# EAGLE design LEDdriverSFE_CREE_02 (EAGLE 6.4)
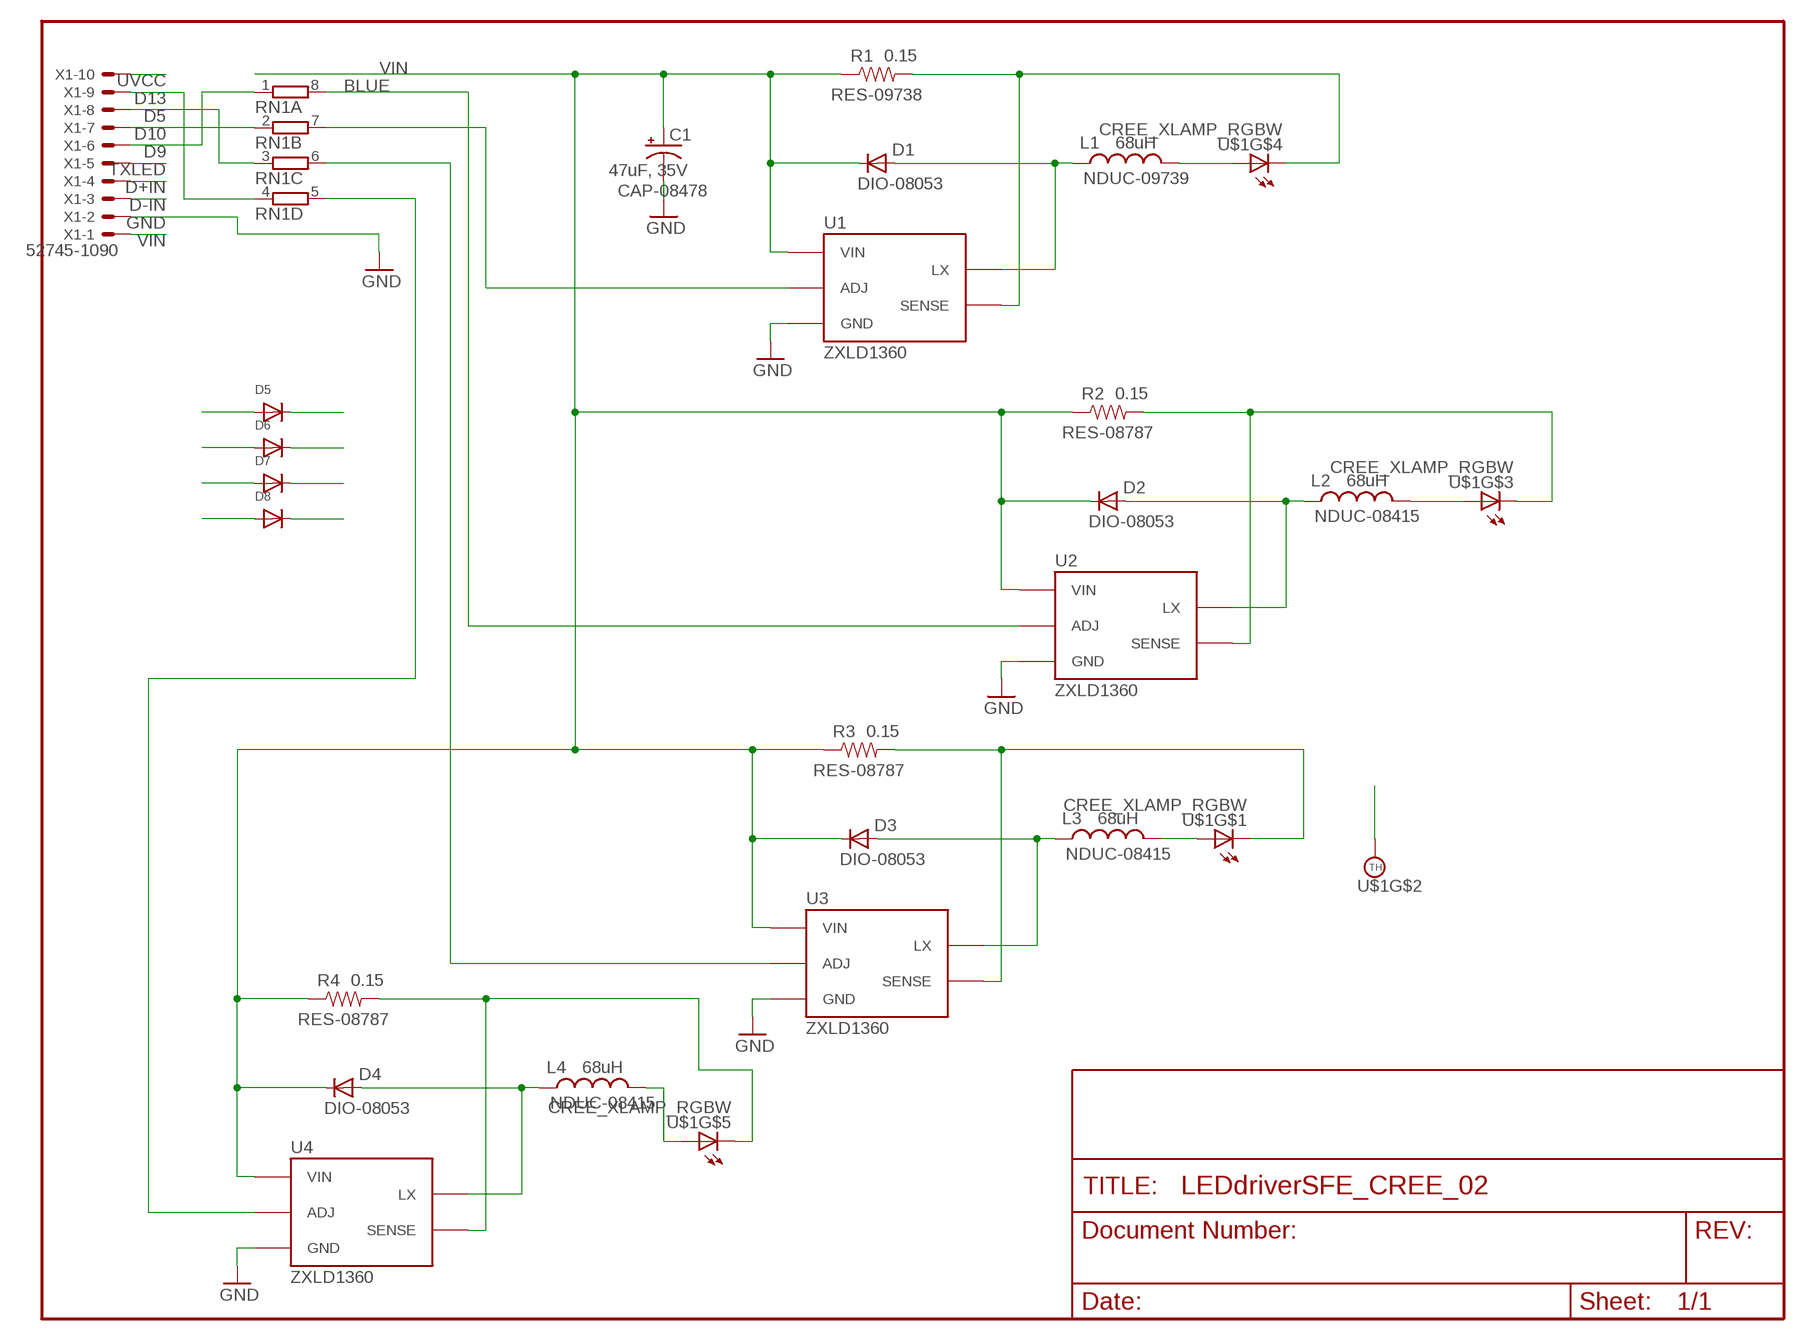
[diagram p0: schematic, sheet 1]

## Parts
C1  47uF, 35V  CAP_POLD  [PANASONIC_D]
D1  MBRA140  DIODESMA  [SMA-DIODE]
D2  MBRA140  DIODESMA  [SMA-DIODE]
D3  MBRA140  DIODESMA  [SMA-DIODE]
D4  MBRA140  DIODESMA  [SMA-DIODE]
D5  DIODESOD-323F  [SOD-323F]
D6  DIODESOD-323F  [SOD-323F]
D7  DIODESOD-323F  [SOD-323F]
D8  DIODESOD-323F  [SOD-323F]
L1  68uH  L-US  [TDK6045]
L2  68uH  L-US  [TDK6045]
L3  68uH  L-US  [TDK6045]
L4  68uH  L-US  [TDK6045]
R1  0.15  RESISTOR0603-RES  [0603-RES]
R2  0.15  RESISTOR0603-RES  [0603-RES]
R3  0.15  RESISTOR0603-RES  [0603-RES]
R4  0.15  RESISTOR0603-RES  [0603-RES]
RN1  4R-NEXBV8V  [EXBV8V]
U1  ZXLD1360  [SOT23-5]
U2  ZXLD1360  [SOT23-5]
U3  ZXLD1360  [SOT23-5]
U4  ZXLD1360  [SOT23-5]
U$1  CREE_XLAMP_RGBW  [CREE_XLAMP_XML]
X1  52745-1090  [52745-1090]

## Nets
BLUE: RN1.8 U2.3(ADJ)
D5: D8.C RN1.3 X1.8
D9: D5.C RN1.1 X1.6
D10: D6.C RN1.2 X1.7
D13: D7.C RN1.4 X1.9
D+IN: X1.4
D-IN: X1.3
GND: C1.- D5.A D6.A D7.A D8.A U1.2(GND) U2.2(GND) U3.2(GND) U4.2(GND) X1.2
GREEN: RN1.7 U1.3(ADJ)
N$1: L1.2 U$1.3(A)
N$2: D2.A L2.1 U2.1(LX)
N$3: R2.2 U2.4(SENSE) U$1.7(C)
N$4: D1.A L1.1 U1.1(LX)
N$5: R1.2 U1.4(SENSE) U$1.6(C)
N$6: L2.2 U$1.2(A)
N$7: D3.A L3.1 U3.1(LX)
N$8: R3.2 U3.4(SENSE) U$1.8(C)
N$9: L3.2 U$1.1(A)
N$11: D4.A L4.1 U4.1(LX)
N$12: R4.2 U4.4(SENSE) U$1.5(C)
N$16: L4.2 U$1.4(A)
RED: RN1.5 U4.3(ADJ)
THERM: U$1.P$1(TH)
TXLED: X1.5
UVCC: X1.10
VIN: C1.+ D1.C D2.C D3.C D4.C R1.1 R2.1 R3.1 R4.1 U1.5(VIN) U2.5(VIN) U3.5(VIN) U4.5(VIN) X1.1
WHITE: RN1.6 U3.3(ADJ)

## Notes on the sheet
- RES-09738
- DIO-08053
- NDUC-09739
- CAP-08478
- RES-08787
- DIO-08053
- NDUC-08415
- RES-08787
- DIO-08053
- NDUC-08415
- RES-08787
- DIO-08053
- NDUC-08415

## Library data of the parts
C1 = SparkFun:CAP_POL: Capacitor Polarized These are standard SMD and PTH capacitors. Normally 10uF, 47uF, and 100uF in electrolytic and tantalum varieties. Always verify the external diameter of the through hole cap, it varies with capacity, voltage, and manufacturer. The EIA devices should be standard.
D1-D4 = SparkFun:DIODE: Diode
D5-D8 = adafruit:DIODE: Diode
L1-L4 = rcl:L-US: INDUCTOR, American symbol
R1-R4 = SparkFun:RESISTOR: Resistor Basic schematic elements and footprints for 0603, 1206, and PTH 1/10th watt (small) resistors.
RN1 = resistor-dil:4R-N: Array Chip Resistor Source: RS Component / Phycomp; OC_FARNELL: unknown; OC_NEWARK: unknown
U1-U4 = SparkFun:ZXLD1360: Adjustable constant current switching driver for high-power LEDs
U$1 = led:CREE_XLAMP_RGBW: Cree XLAMP XM-L Color RGBW led http://www.mouser.com/ds/2/90/XLampXML_Color-218132.pdf
X1 = con-molex:52745-1090: FFC/FPC-to-Board 0.50mm (.020") SMT Top Contact Right Angle, ZIF, Style Receptacle 52745 / 52435 Source: http://www.molex.com/product/ffc/52745.html; MPN: 52745-1090; OC_FARNELL: unknown; OC_NEWARK: 92M6380

## Board
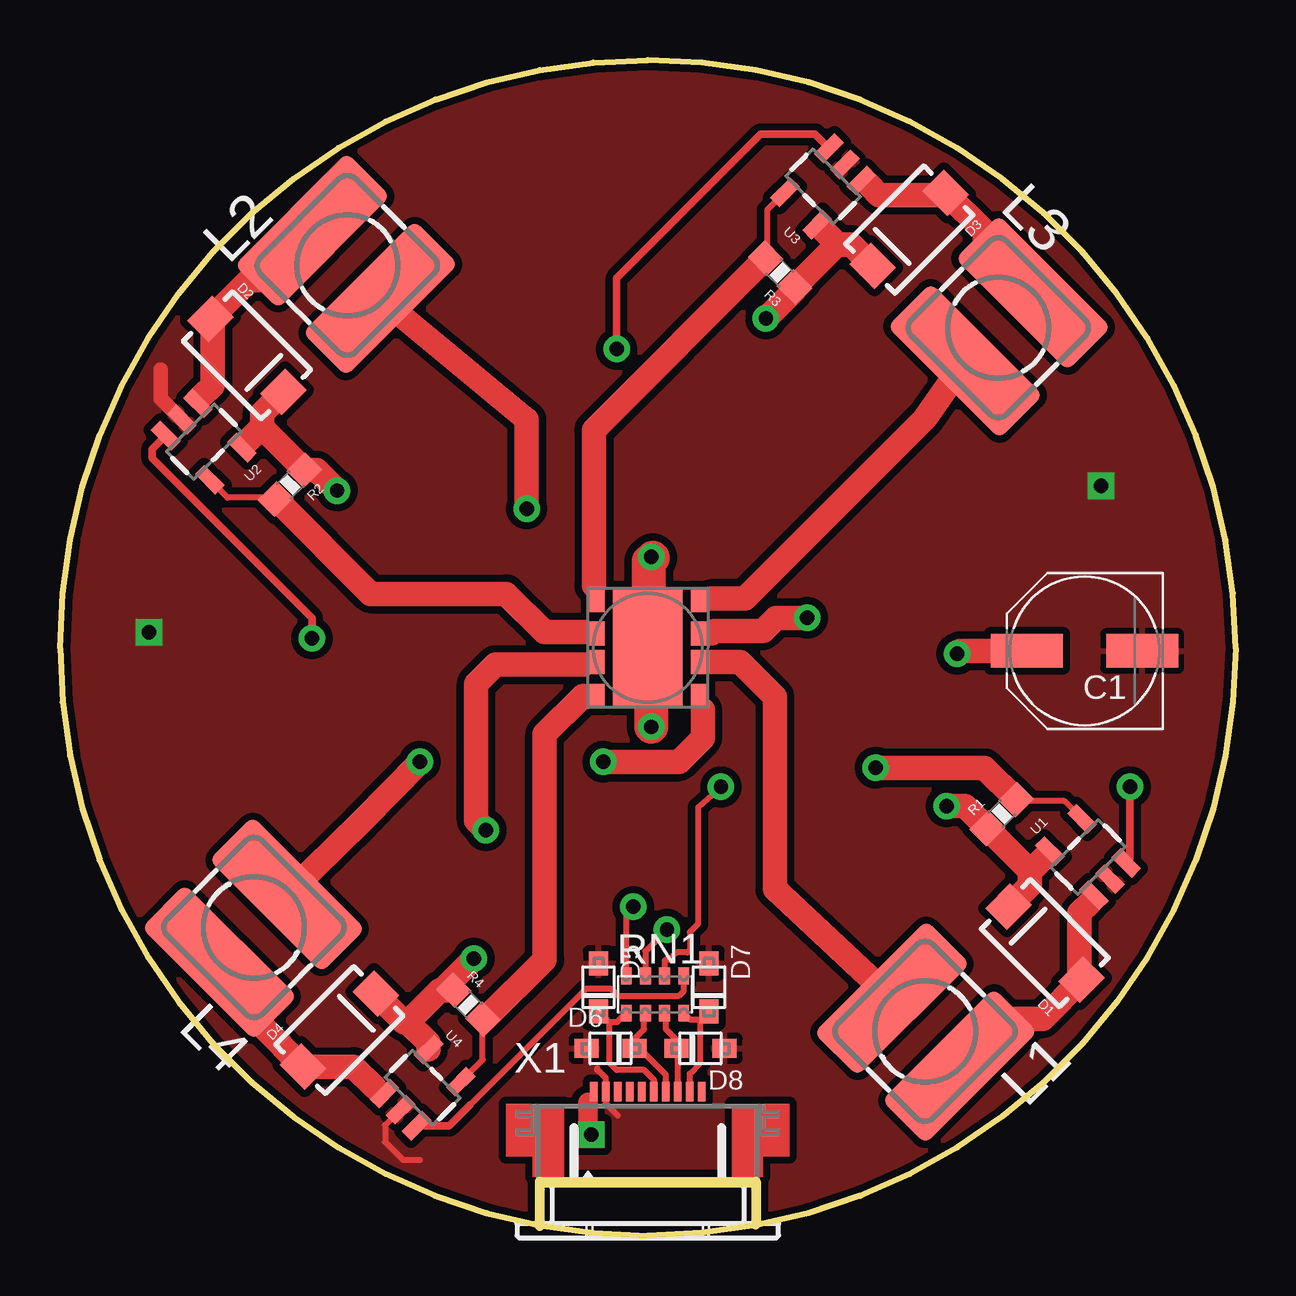
[diagram p1: board, top side]
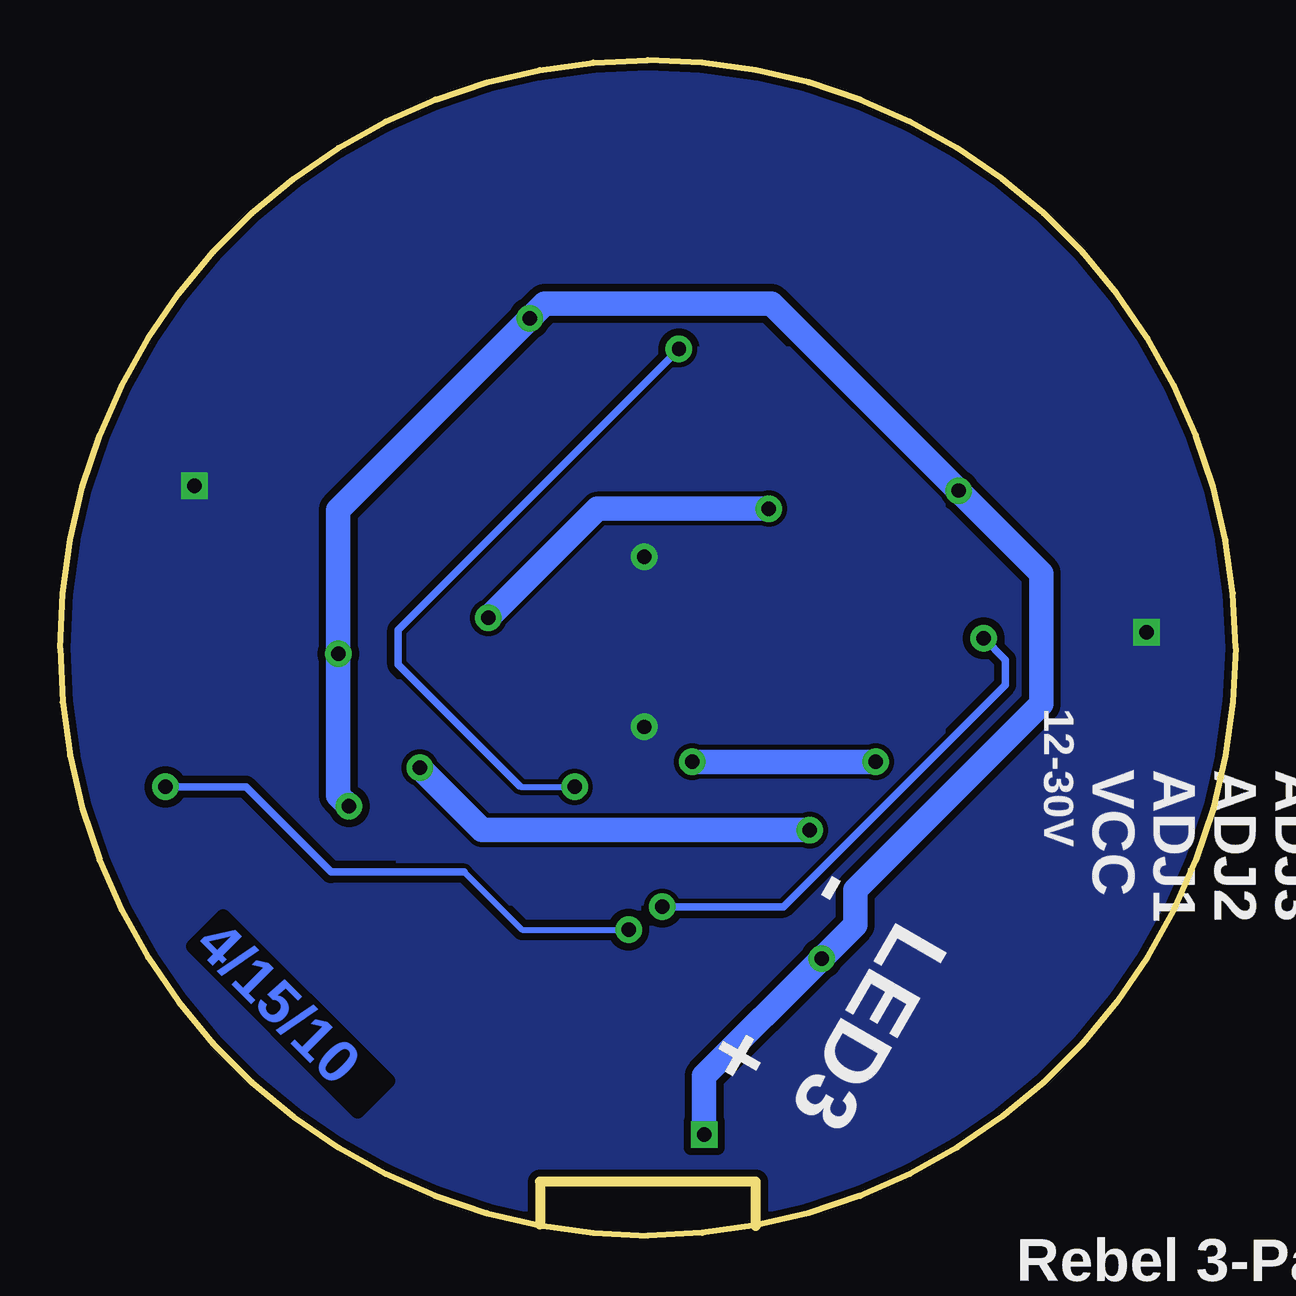
[diagram p2: board, bottom side, seen from below]

Size 49 x 49 mm. Coordinates in mm from the lower left corner, seen from the top.
Outline: 20,0.4 20,2.25 29,2.25 29,0.45
Outline: 0,24.5 arc-90 24.5,49 arc-90 49,24.5 arc-90 24.5,0 arc-90 0,24.5
Copper layers (1*16): Top 0.035mm / dielectric 1.5mm / Bottom 0.035mm
Design rules "default": minimum track width 8mil, minimum drill 20mil, track to track 8mil, track to pad 8mil, pad to pad 8mil, via to via 8mil, smd to smd 8mil, copper to edge 8mil, drill to drill 8mil, minimum pad ring 12mil, minimum via ring 10mil, stop-mask expansion 4mil, vias tented up to drill 24mil, thermal gap 10mil

### Footprints (pad centres in the part's own frame; a part is rotated, then mirrored left to right if it is on the bottom)
PANASONIC_D = smd 3 x 1.4: + 2.4,0; - -2.4,0
SMA-DIODE = smd 1.27 x 1.47: A -2.15,0; C 2.15,0
SOD-323F = smd 1 x 0.8: A -1,0; C 1,0
TDK6045 = smd 6.6 x 2.55: 1 0,2.05; 2 0,-1.95
0603-RES = smd 1.1 x 1: 1 -0.85,0; 2 0.85,0
EXBV8V = smd 0.45 x 0.7: 1 -1.2,-0.775; 2 -0.4,-0.775; 3 0.4,-0.775; 4 1.2,-0.775; 5 1.2,0.775; 6 0.4,0.775; 7 -0.4,0.775; 8 -1.2,0.775
SOT23-5 = smd 0.55 x 1.2: 1 -0.95,-1.3; 2 0,-1.3; 3 0.95,-1.3; 4 0.95,1.3; 5 -0.95,1.3
CREE_XLAMP_XML = smd 0.7 x 1: 1 2.15,2; 2 2.15,0.6; 3 2.15,-0.6; 4 2.15,-2; 5 -2.15,-2; 6 -2.15,-0.6; 7 -2.15,0.6; 8 -2.15,2 | smd 2.9 x 5: P$1 0,0
52745-1090 = smd 0.3 x 0.8: 1 -2.25,2.5; 2 -1.75,2.5; 3 -1.25,2.5; 4 -0.75,2.5; 5 -0.25,2.5; 6 0.25,2.5; 7 0.75,2.5; 8 1.25,2.5; 9 1.75,2.5; 10 2.25,2.5

### Placement (x,y rotation side)
C1  42.71,24.37 180 top
D1  41.05,12.18 135 top
D2  7.79,36.69 315 top
D3  35.4,41.93 225 top
D4  11.64,8.56 45 top
D5  22.45,10.35 270 top
D6  22.95,7.8 0 top
D7  27.05,10.35 270 top
D8  26.7,7.8 180 top
L1  36.05,8.51 225 top
L2  11.98,40.44 45 top
L3  39.11,37.84 315 top
L4  8.09,12.84 135 top
R1  39.26,17.57 45 top
R2  9.59,31.3 225 top
R3  30.01,40.14 135 top
R4  17.02,9.62 315 top
RN1  24.8,10.05 0 top
U1  42.85,15.78 45 top
U2  6,33.09 225 top
U3  31.81,43.73 135 top
U4  15.12,6.16 315 top
U$1  24.5,24.5 0 top
X1  24.5,3.5 0 top

### Tracks (layer width: path | path; a pad name or v marks a point on that pad's centre or on a via)
BLUE  (via drill 0.6)
  Top 0.254: U2.3 | v23.9,13.7 23.6,13.4 RN1.8
  Top 0.305: v10.5,24.9 10.5,25.75 3.85,32.4 3.85,32.78 U2.3
  Bottom 0.305: v23.9,13.7 18.85,13.7 9.6,22.95 9.6,24 v10.5,24.9
D5
  Top 0.254: X1.8 25.75,7.75 D8.C 25.7,8.15 25.25,8.6 25.25,9.22 RN1.3
D9
  Top 0.254: 24.75,6.4 X1.6 24.75,6.5 24.35,6.9 23.2,6.9 22.9,7.2 22.9,8.9 | 22.9,8.9 D5.C | 22.9,8.9 23.23,8.9 RN1.1
D10
  Top 0.254: X1.7 25.25,6.7 24.15,7.8 D6.C 23.95,8.2 24.35,8.6 24.35,9.22 RN1.2
D13
  Top 0.254: X1.9 26.25,6.75 26.7,7.2 26.7,9 | 26.7,9 D7.C | 26.7,9 26.27,9 RN1.4
GND  (via drill 0.6)
  Top 0.254: U4.2 13.55,4.6 13.55,3.9 14.3,3.15 15,3.15 | 23.25,5 22.75,5.5 X1.2 22.75,6.55 22.4,6.9 22.4,6.95
  Top 0.61: U2.2 4.2,34.89 4.2,36.1
  other vias: 43.4,31.25 3.7,25.15
  pour Bottom (isolate 0.305): -0.15,-0.15 49.15,-0.15 49.15,49.15 -0.15,48.65
  pour Top (isolate 0.305): 0,49 49,49 49,0 0,0
GREEN  (via drill 0.6)
  Top 0.254: v25.3,12.75 24.4,11.85 RN1.7
  Top 0.305: v44.6,18.7 44.6,15.69 U1.3
  Bottom 0.254: 32.15,15.15 29.75,12.75 v25.3,12.75
  Bottom 0.305: 32.15,15.15 37.7,15.15 41.25,18.7 v44.6,18.7
N$1
  Top 0.254: 27.2,23.9 U$1.3
  Top 1.016: L1.2 29.8,14.46 29.8,22.45 28.35,23.9 27.2,23.9
N$2
  Top 0.406: 5.91,34.98 5.75,34.82 U2.1
  Top 1.016: L2.1 9.14,39.83 7.88,39.83 D2.A 6.36,38.12 6.36,35.43 5.91,34.98
N$3
  Top 0.254: R2.2 8.93,30.76 6.99,30.76 U2.4 | 21.85,25.15 21.9,25.1 U$1.7
  Top 1.016: R2.2 9,30.7 12.95,26.75 18.6,26.75 20.2,25.15 21.85,25.15
N$4
  Top 0.406: 42.94,13.89 43.1,14.05 U1.1
  Top 1.016: L1.1 39.71,9.04 40.96,9.04 D1.A 42.49,10.75 42.49,13.44 42.94,13.89
N$5  (via drill 0.6)
  Top 0.254: R1.2 39.92,18.11 41.86,18.11 U1.4 | 21.85,23.8 21.95,23.9 U$1.6
  Top 1.016: R1.2 38.53,19.5 v34,19.5 | v17.75,16.9 17.35,17.3 17.35,23 18.15,23.8 21.85,23.8
  Bottom 1.016: v34,19.5 31.4,16.9 v17.75,16.9
N$6  (via drill 0.6)
  Top 0.254: 27.15,25.1 U$1.2
  Top 1.016: L2.2 19.45,34.01 v19.45,30.3 | v31.15,25.75 29.85,25.75 29.3,25.2 27.25,25.2 27.15,25.1
  Bottom 1.016: v19.45,30.3 26.6,30.3 v31.15,25.75
N$7
  Top 0.406: 33.69,43.82 33.54,43.98 U3.1
  Top 1.016: L3.1 38.54,40.59 38.54,41.84 36.93,43.45 D3.A 36.84,43.37 34.14,43.37 33.69,43.82
N$8
  Top 0.254: R3.2 29.47,40.8 29.47,42.74 U3.4 | 22.25,27.1 22.35,27 U$1.8
  Top 1.016: R3.2 22.25,33.58 22.25,27.1
N$9
  Top 0.254: 27.15,26.55 27.1,26.5 U$1.1
  Top 1.016: L3.2 36.06,34.06 28.55,26.55 27.15,26.55
N$11
  Top 0.254: 13.12,6.17 13.37,5.92 U4.1
  Top 1.016: L4.1 8.16,9.91 8.41,9.95 8.41,8.75 D4.A 12.24,7.04 13.12,6.17
N$12
  Top 0.254: U4.4 17.62,7.32 R4.2 | 21.8,22.5 U$1.5
  Top 1.016: R4.2 17.72,9.02 20.2,11.5 20.2,20.9 21.8,22.5
N$16  (via drill 0.6)
  Top 0.254: 26.8,21.9 26.65,22.05 U$1.4
  Top 1.016: L4.2 12.59,17.29 v15,19.75 | v22.65,19.75 25.8,19.75 26.8,20.75 26.8,21.9
  Bottom 1.016: v15,19.75 v22.65,19.75
RED
  Top 0.254: 17.1,5.45 21.95,10.3 22.95,10.3 23.25,10 25.8,10 26,10.2 RN1.5
  Top 0.305: 17.1,5.45 16.22,4.57 U4.3
THERM  (via drill 0.6)
  Top 0.254: 24.55,23.05 24.5,23.1 U$1.P$1
  Top 1.422: v24.65,21.2 24.65,22.95 24.55,23.05 24.55,28.1 24.7,28.25
  other vias: 24.65,28.3
  pour Bottom: 12.35,36.9 34.85,36.9 34.85,13.9 12.25,13.9 12.25,36.75
VIN  (via drill 0.6)
  Top 0.254: 22,5.55 22.25,5.8 X1.1
  Top 0.406: 41.05,15.78 41.26,15.98 U1.5 | 7.79,33.09 7.59,32.89 U2.5 | 31.81,41.93 31.6,42.14 U3.5
  Top 0.813: v22.15,4.2 22,4.35 22,5.55
  Top 1.016: D1.C 40.42,14.6 40.42,15.15 | 40.42,15.15 41.05,15.78 | 40.42,15.15 40.42,15.2 R1.1 37.73,17.9 v36.95,17.9 | 8.42,33.99 8.42,34.27 D2.C | 8.42,33.99 8.42,33.72 7.79,33.09 | 8.42,33.99 8.42,33.67 R2.1 10.7,31.9 v11.55,31.05 | D3.C 32.99,41.3 32.71,41.3 | 32.71,41.3 32.44,41.3 31.81,41.93 | 32.71,41.3 32.38,41.3 R3.1 30.61,39.41 v29.43,38.23 | D4.C 14.35,8.89 14.49,8.89 | 14.49,8.89 15.82,10.22 15.92,10.22 | 15.92,10.22 R4.1 | 14.49,8.89 15.36,8.02 U4.5 | C1.+ 37.52,24.37 v37.4,24.25 | 15.92,10.22 v17.25,11.55
  Bottom 1.016: v36.95,17.9 37.4,18.35 v37.4,24.25 37.4,30.25 v29.43,38.23 28.8,38.85 19.35,38.85 v11.55,31.05 8.1,27.6 8.1,22.15 15.85,14.4 15.85,12.95 v17.25,11.55 22.15,6.65 v22.15,4.2
WHITE  (via drill 0.6)
  Top 0.254: RN1.6 25.2,11.45 25.25,11.5 25.4,11.5 25.7,11.8 26.15,11.8 26.25,11.9 26.25,12.65 26.6,13 26.6,17.85 v27.55,18.7
  Top 0.305: v23.2,36.95 23.2,39.9 29.2,45.9 31.48,45.9 U3.3
  Bottom 0.254: 29.85,18.75 29.8,18.7 v27.55,18.7
  Bottom 0.305: 29.85,18.75 34.9,23.8 34.9,25.25 v23.2,36.95

### Text on the board
Bottom: 4/15/10
bPlace: 12-30V | GND | ADJ3 | ADJ2 | ADJ1 | VCC | - | + | LED3 | + | - | LED2 | Rebel 3-Pack | Tri-Color Driver | LED1 | + | -